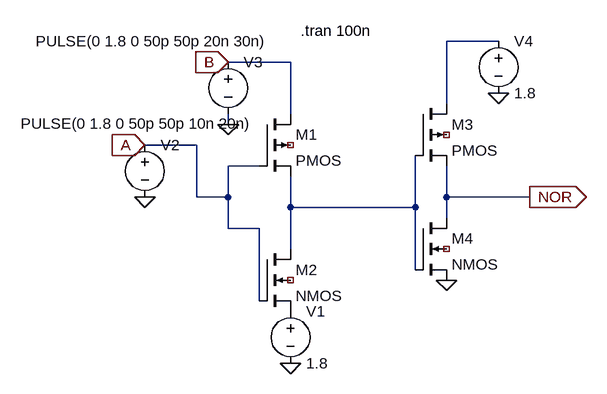
[diagram p0: schematic NOR.asc]
NOR.asc, the LTspice schematic file:
Version 4.1
SHEET 1 880 680
WIRE 528 -64 448 -64
WIRE 208 -32 112 -32
WIRE 448 32 448 -64
WIRE 208 48 208 -32
WIRE 112 64 112 48
WIRE 64 96 -16 96
WIRE 160 128 112 128
WIRE 64 176 64 96
WIRE 112 176 112 128
WIRE 112 176 64 176
WIRE 448 176 448 128
WIRE 576 176 448 176
WIRE 208 192 208 144
WIRE 400 192 400 112
WIRE 400 192 208 192
WIRE 448 208 448 176
WIRE 112 224 112 176
WIRE 160 224 112 224
WIRE 208 256 208 192
WIRE 400 288 400 192
WIRE 160 336 160 224
FLAG -16 176 0
FLAG -16 96 A
IOPIN -16 96 In
FLAG 112 -32 B
IOPIN 112 -32 In
FLAG 576 176 NOR
IOPIN 576 176 Out
FLAG 112 64 0
FLAG 208 432 0
FLAG 528 16 0
FLAG 448 304 0
SYMBOL pmos4 160 48 R0
SYMATTR InstName M1
SYMBOL nmos4 160 256 R0
SYMATTR InstName M2
SYMBOL voltage -16 80 R0
WINDOW 3 -191 -17 Left 2
WINDOW 123 0 0 Left 0
WINDOW 39 0 0 Left 0
SYMATTR Value PULSE(0 1.8 0 50p 50p 10n 20n)
SYMATTR InstName V2
SYMBOL voltage 112 -48 R0
WINDOW 3 -296 -16 Left 2
WINDOW 123 0 0 Left 0
WINDOW 39 0 0 Left 0
SYMATTR Value PULSE(0 1.8 0 50p 50p 20n 30n)
SYMATTR InstName V3
SYMBOL voltage 208 336 R0
WINDOW 123 0 0 Left 0
WINDOW 39 0 0 Left 0
SYMATTR InstName V1
SYMATTR Value 1.8
SYMBOL pmos4 400 32 R0
SYMATTR InstName M3
SYMBOL nmos4 400 208 R0
SYMATTR InstName M4
SYMBOL voltage 528 -80 R0
WINDOW 123 0 0 Left 0
WINDOW 39 0 0 Left 0
SYMATTR InstName V4
SYMATTR Value 1.8
TEXT 224 -80 Left 2 !.tran 100n

The netlist it stands for:
* NOR.asc
M1 B A N002 NC_01 PMOS
M2 N002 A P001 NC_02 NMOS
V2 A 0 PULSE(0 1.8 0 50p 50p 10n 20n)
V3 B 0 PULSE(0 1.8 0 50p 50p 20n 30n)
V1 P001 0 1.8
M3 N001 N002 NOR NC_03 PMOS
M4 NOR N002 0 NC_04 NMOS
V4 N001 0 1.8
.model NMOS NMOS
.model PMOS PMOS
.lib standard.mos
.tran 100n
.backanno
.end